# Altium project Design Documents.PrjPcb
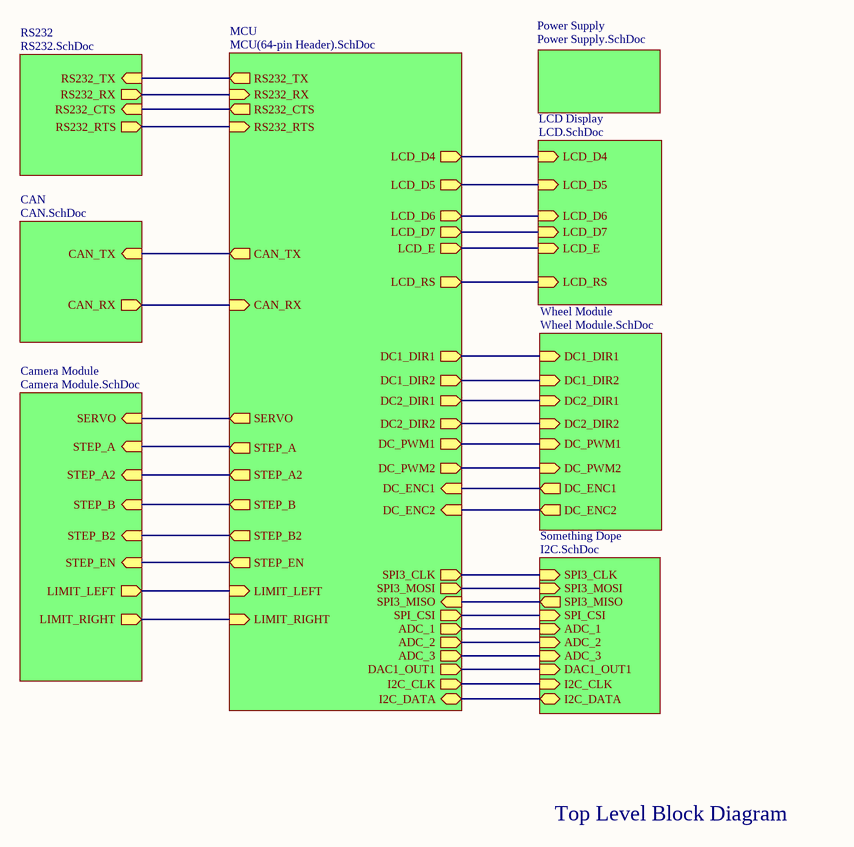
[diagram p0: Top Level Schematic.SchDoc]
9 sheets, 81 parts. Net scope: hierarchical (ports join the sheet entries above them; power ports are global).
Board file: Controller PCB.PcbDoc
Sheets:
  Top Level Schematic.SchDoc
    RS232 = RS232.SchDoc
    MCU = MCU(64-pin Header).SchDoc
    CAN = CAN.SchDoc
    Camera Module = Camera Module.SchDoc
    Wheel Module = Wheel Module.SchDoc
    Power Supply = Power Supply.SchDoc
    LCD Display = LCD.SchDoc
    Something Dope = I2C.SchDoc

## Sheet Top Level Schematic.SchDoc
size A; DocumentNumber: 1; SheetNumber: 1; SheetTotal: 9

### Sub-sheets
Camera Module = Camera Module.SchDoc: SERVO (in), STEP_A (in), STEP_A2 (in), STEP_B (in), STEP_B2 (in), STEP_EN (in), LIMIT_LEFT (out), LIMIT_RIGHT (out)
CAN = CAN.SchDoc: CAN_TX (in), CAN_RX (out)
LCD Display = LCD.SchDoc: LCD_D4 (in), LCD_D5 (in), LCD_D6 (in), LCD_E (in), LCD_RS (in), LCD_D7 (in)
MCU = MCU(64-pin Header).SchDoc: RS232_TX (out), RS232_RX (in), RS232_CTS (out), RS232_RTS (in), SERVO (out), STEP_A (out), STEP_A2 (out), STEP_B (out), STEP_B2 (out), STEP_EN (out), DC1_DIR1 (out), DC1_DIR2 (out), DC2_DIR1 (out), DC2_DIR2 (out), DC_PWM1 (out), DC_PWM2 (out), DC_ENC1 (in), DC_ENC2 (in), LIMIT_LEFT (in), LIMIT_RIGHT (in), CAN_TX (out), CAN_RX (in), LCD_D4 (out), LCD_D5 (out), LCD_D6 (out), LCD_E (out), LCD_RS (out), ADC_1 (out), ADC_2 (out), ADC_3 (out), DAC1_OUT1 (out), SPI_CSI (out), SPI3_MISO (in), SPI3_MOSI (out), SPI3_CLK (out), LCD_D7 (out), I2C_CLK (out), I2C_DATA (bidir)
Power Supply = Power Supply.SchDoc: no entries
RS232 = RS232.SchDoc: RS232_TX (in), RS232_RX (out), RS232_CTS (in), RS232_RTS (out)
Something Dope = I2C.SchDoc: SPI3_CLK (in), SPI3_MOSI (in), SPI3_MISO (out), SPI_CSI (in), ADC_1 (in), ADC_2 (in), ADC_3 (in), DAC1_OUT1 (in), I2C_CLK (in), I2C_DATA (bidir)
Wheel Module = Wheel Module.SchDoc: DC1_DIR1 (in), DC1_DIR2 (in), DC2_DIR1 (in), DC2_DIR2 (in), DC_PWM1 (in), DC_PWM2 (in), DC_ENC1 (out), DC_ENC2 (out)

### Nets
NetC9_2: sheet MCU/CAN_RX, sheet CAN/CAN_RX
NetCN1_1: sheet MCU/SPI3_CLK, sheet Something Dope/SPI3_CLK
NetCN1_2: sheet MCU/SPI3_MISO, sheet Something Dope/SPI3_MISO
NetCN1_3: sheet MCU/SPI3_MOSI, sheet Something Dope/SPI3_MOSI
NetCN1_4: sheet MCU/SPI_CSI, sheet Something Dope/SPI_CSI
NetCN1_21: sheet MCU/LCD_D7, sheet LCD Display/LCD_D7
NetCN1_25: sheet RS232/RS232_RTS, sheet MCU/RS232_RTS
NetCN1_27: sheet RS232/RS232_CTS, sheet MCU/RS232_CTS
NetCN1_28: sheet MCU/DC1_DIR1, sheet Wheel Module/DC1_DIR1
NetCN1_30: sheet MCU/DC1_DIR2, sheet Wheel Module/DC1_DIR2
NetCN1_32: sheet MCU/DAC1_OUT1, sheet Something Dope/DAC1_OUT1
NetCN1_34: sheet MCU/DC2_DIR1, sheet Wheel Module/DC2_DIR1
NetCN1_35: sheet MCU/ADC_3, sheet Something Dope/ADC_3
NetCN1_36: sheet MCU/ADC_2, sheet Something Dope/ADC_2
NetCN1_37: sheet MCU/STEP_EN, sheet Camera Module/STEP_EN
NetCN1_38: sheet MCU/ADC_1, sheet Something Dope/ADC_1
NetCN2_1: sheet MCU/STEP_B2, sheet Camera Module/STEP_B2
NetCN2_2: sheet MCU/STEP_B, sheet Camera Module/STEP_B
NetCN2_3: sheet MCU/I2C_CLK, sheet Something Dope/I2C_CLK
NetCN2_4: sheet MCU/STEP_A, sheet Camera Module/STEP_A
NetCN2_5: sheet MCU/I2C_DATA, sheet Something Dope/I2C_DATA
NetCN2_6: sheet RS232/RS232_RX, sheet MCU/RS232_RX
NetCN2_12: sheet MCU/CAN_TX, sheet CAN/CAN_TX
NetCN2_13: sheet MCU/DC_ENC1, sheet Wheel Module/DC_ENC1
NetCN2_15: sheet MCU/DC_ENC2, sheet Wheel Module/DC_ENC2
NetCN2_16: sheet MCU/LCD_E, sheet LCD Display/LCD_E
NetCN2_17: sheet MCU/LCD_D6, sheet LCD Display/LCD_D6
NetCN2_18: sheet MCU/SERVO, sheet Camera Module/SERVO
NetCN2_19: sheet MCU/STEP_A2, sheet Camera Module/STEP_A2
NetCN2_21: sheet MCU/DC_PWM2, sheet Wheel Module/DC_PWM2
NetCN2_22: sheet MCU/LIMIT_LEFT, sheet Camera Module/LIMIT_LEFT
NetCN2_23: sheet MCU/DC_PWM1, sheet Wheel Module/DC_PWM1
NetCN2_24: sheet MCU/DC2_DIR2, sheet Wheel Module/DC2_DIR2
NetCN2_25: sheet MCU/LIMIT_RIGHT, sheet Camera Module/LIMIT_RIGHT
NetCN2_27: sheet MCU/LCD_D4, sheet LCD Display/LCD_D4
NetCN2_29: sheet MCU/LCD_D5, sheet LCD Display/LCD_D5
NetCN2_30: sheet MCU/LCD_RS, sheet LCD Display/LCD_RS
NetCN2_34: sheet RS232/RS232_TX, sheet MCU/RS232_TX

### Notes on the sheet
- Top Level Block Diagram

## Sheet RS232.SchDoc
size A; SheetNumber: 4; SheetTotal: 9
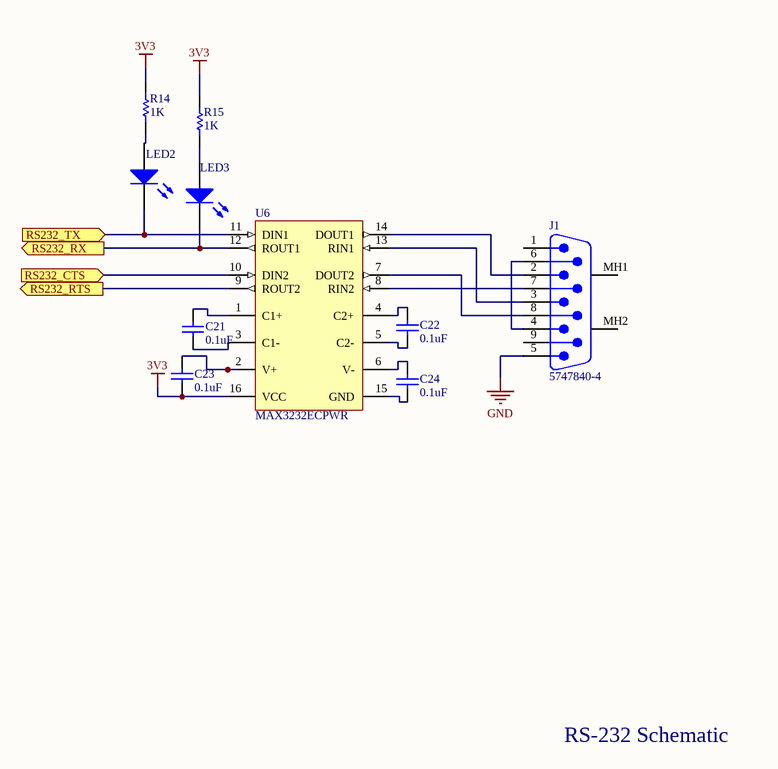
[diagram p1: RS232.SchDoc]

### Parts
C21  0.1uF  [CAPC1608X90X35LL15T15]
C22  0.1uF  [CAPC1608X90X35LL15T15]
C23  0.1uF  [CAPC1608X90X35ML15T15]
C24  0.1uF  [CAPC1608X90X35LL15T15]
J1  5747840-4  [TECO-5747840-4_V]
LED2  (no value)  [1204]
LED3  (no value)  [1204]
R14  1K  [RESC2013X60X30ML20T20]
R15  1K  [RESC2013X60X30ML20T20]
U6  MAX3232ECPWR  [PW0016A_M]

### Ports
RS232_CTS (in), RS232_RTS (out), RS232_RX (out), RS232_TX (in)

### Nets
3V3: C23.1 R14.1 R15.1 U6.16(VCC)
GND: J1.5
NetC21_1: C21.1 U6.3(C1-)
NetC21_2: C21.2 U6.1(C1+)
NetC22_1: C22.1 U6.5(C2-)
NetC22_2: C22.2 U6.4(C2+)
NetC23_2: C23.2 U6.2(V+)
NetC24_1: C24.1 U6.15(GND)
NetC24_2: C24.2 U6.6(V-)
NetCN1_25: U6.9(ROUT2) ; port RS232_RTS
NetCN1_27: U6.10(DIN2) ; port RS232_CTS
NetCN2_6: LED3.1(K) U6.12(ROUT1) ; port RS232_RX
NetCN2_34: LED2.1(K) U6.11(DIN1) ; port RS232_TX
NetJ1_2: J1.2 U6.14(DOUT1)
NetJ1_3: J1.3 U6.13(RIN1)
NetJ1_4: J1.4 J1.6
NetJ1_7: J1.7 U6.8(RIN2)
NetJ1_8: J1.8 U6.7(DOUT2)
NetLED2_2: LED2.2(A) R14.2
NetLED3_2: LED3.2(A) R15.2

Not connected (* = marked no-connect by the designer): J1 1 9 MH1 MH2

### Notes on the sheet
- RS-232 Schematic

### Library data of the parts
C21-C24 = CMP-2006-04389-2: Chip Capacitor, 100 nF, +/- 10%, 50 V, -55 to 125 degC, 0603 (1608 Metric), RoHS, Tape and Reel; Case\Package: 0603; Type (Capacitors): X7R; Capacitance: 100 nF; Voltage Rating: 50 V; Pins: 2; Max Operating Temperature: 125 degC; Min Operating Temperature: -55 degC; Case Code (Imperial): 0603; DatasheetVersion: 07/2016; Package Quantity: 4000; Length: 1.6 mm; REACH SVHC: No SVHC; Packaging: Tape and Reel; Case Code (Metric): 1608; Mounting Technology: Surface Mount; RoHSCompliant: true; Height: 0.9 mm; ComponentLink1URL: http://www.avx.com/; ComponentLink2URL: http://datasheets.avx.com/X7RDielectric.pdf; Mount: Surface Mount; ComponentLink2Description: Datasheet; Width: 0.81 mm; PackageReference: 0603; PackageDescription: 2-Pin Surface Mount Device, Body 1.6 x 0.81 mm; Radiation Hardening: No; ComponentLink1Description: Manufacturer URL; Voltage Rating (DC): 50 V; Tolerance: 10%
J1 = CMP-2000-05648-1: Male D-Sub Connector, Pitch 1.37 mm, 9 Position, Height 12.93 mm, Tail Length 3.55 mm, -55 to 105 degC, RoHS, Tray; Manufacturer: TE Connectivity; Current Rating: 6A; 3D Model: 5747840-4.pdf; Connector Type: Plug,MalePins; Catalog Drawings: AMPD-SubMale.318; Other Names: A32092; Product Training Modules: AMPLIMITED-SubConnectors; Number of Positions: 9; Dynamic Catalog: AMPLIMITEHD-20Series; Flange Feature: Housing/Shell(4-40); Mating Products: 5-747905-7-ND / -CONND-SUBRCPT9POSVERTSLD / 5-787355-1-ND / -CONNRCPT9POSVERTSOLDERCUP / 5746861-4-ND / -CONNRECEPT9POSGOLDIDC / A32510-ND / -CONND-SUBRCPT9POSSLDCUPAU / AFL09B-ND / -CONND-SUBRECEPT9POS30GOLD / A31975-ND / -CONND-SUBRECEPT9P22-26AWGAU / A31974-ND / -CONND-SUBRECEPT9P20-22AWGAU / A31973-ND / -CONND-SUBRECEPT9P26-30AWGAU / A31931-ND / -CONND-SUBRCPT9POS22-26AWGAU; Featured Product: AMPLIMITED-SubminiatureConnectors; Voltage Rating: 125V; Connector Style: D-Sub; Mounting Technology: ThroughHole; Features: BoardLock,GroundStrap,GroundingIndents; Operating Temperature: -55°C~105°C; Standard Package: 130; Termination: Solder; Contact Finish: Gold; Family: D-SubConnectors; Package Reference: 5747840-4; Package Description: 9-Pin Through Hole Device, Body 30.81 x 18.62 mm, Pitch 1.37 mm; Category: Connectors,Interconnects; Series: AMPLIMITEHD-20; Manufacturer URL: http://www.te.com/; Shell Size, Connector Layout: 1(DE,E); Color: Black; RoHS Information: 5747840-4StatementofCompliance; Shell Material, Finish: Steel,TinPlated; Datasheet URL: http://www.te.com/commerce/DocumentDelivery/DDEController?Action=showdoc&DocId=Customer+Drawing%7F5747840%7FD%7Fpdf%7FEnglish%7FENG_CD_5747840_D.pdf%7F5747840-4; Contact Finish Thickness: Flash; Datasheet Version: Rev. D, 01/2013; Mounting Type: ThroughHole,RightAngle; Number of Rows: 2; Contact Type: Signal
LED2 LED3 = CMP-1427-00002-1: SMD Side view mono-color Chip LED-Round , WL-SMSW, Green; PartNumber: 155124GS73200; Manufacturer: Wuerth Elektronik; Color: Yellow; PackageReference: 1204; ComponentLink2URL: http://katalog.we-online.com/led/datasheet/155124GS73200.pdf; ComponentLink2Description: Datasheet; ComponentLink1URL: http://www.we-online.com; ComponentLink1Description: Manufacturer URL
R14 R15 = CMP-2001-04656-1: Part Number: RK73B2ATTD102J; Manufacturer: KOA Speer
U6 = CMP-0299-01479-2: 3-V to 5.5-V Multichannel RS-232 Line Driver / Receiver with ±15-kV IEC ESD Protection, 0 to 70 degC, 16-Pin TSSOP (PW), Green (RoHS & no Sb/Br); Supply Voltage(s)(V): 3.3 or 5.0; Receivers Per Package: 2; ESD HBM(kV): +/-15; IEC-61000-4-2 SUPPORT: TRUE; ICC(Max)(mA): 1; ComponentLink2Description: Datasheet; PackageVersion: revG, Feb-2011; ComponentLink3Description: Package Specification; DatasheetVersion: SLLS664A; Drivers Per Package: 2; PackageDescription: 16-Pin Plastic Thin Small Outline Package 5 x 4.4 mm Body ,0.65 mm Pitch; ComponentLink3URL: http://www.ti.com/litv/pdf/mpds361; ComponentLink1Description: Manufacturer URL; ComponentLink2URL: http://www.ti.com/general/docs/lit/getliterature.tsp?genericPartNumber=MAX3232E&fileType=pdf; PackageReference: PW0016A; RS-232: TRUE; SubFamily: RS-232; Single Supply: TRUE; ComponentLink1URL: www.ti.com

## Sheet MCU(64-pin Header).SchDoc: 64-Pin Header (MCU)
size A; DrawnBy: Jeff Scherer; DocumentNumber: 2; Revision: 1; SheetNumber: 2; SheetTotal: 9
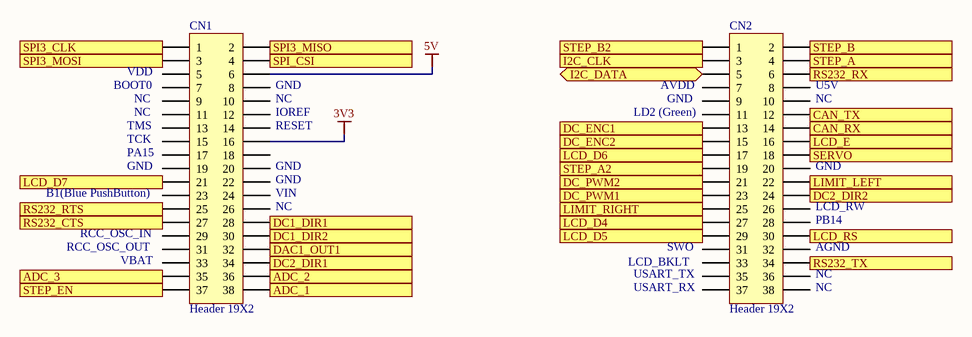
[diagram p2: MCU(64-pin Header).SchDoc]

### Parts
CN1  Header 19X2  [HDR2X19]
CN2  Header 19X2  [HDR2X19]

### Ports
ADC_1 (out), ADC_2 (out), ADC_3 (out), CAN_RX (in), CAN_TX (out), DAC1_OUT1 (out), DC1_DIR1 (out), DC1_DIR2 (out), DC2_DIR1 (out), DC2_DIR2 (out), DC_ENC1 (in), DC_ENC2 (in), DC_PWM1 (out), DC_PWM2 (out), I2C_CLK (out), I2C_DATA (bidir), LCD_D4 (out), LCD_D5 (out), LCD_D6 (out), LCD_D7 (out), LCD_E (out), LCD_RS (out), LIMIT_LEFT (in), LIMIT_RIGHT (in), RS232_CTS (out), RS232_RTS (in), RS232_RX (in), RS232_TX (out), SERVO (out), SPI3_CLK (out), SPI3_MISO (in), SPI3_MOSI (out), SPI_CSI (out), STEP_A2 (out), STEP_A (out), STEP_B2 (out), STEP_B (out), STEP_EN (out)

### Nets
3V3: CN1.16
5V: CN1.6
NetC9_2: CN2.14 ; port CAN_RX
NetCN1_1: CN1.1 ; port SPI3_CLK
NetCN1_2: CN1.2 ; port SPI3_MISO
NetCN1_3: CN1.3 ; port SPI3_MOSI
NetCN1_4: CN1.4 ; port SPI_CSI
NetCN1_21: CN1.21 ; port LCD_D7
NetCN1_25: CN1.25 ; port RS232_RTS
NetCN1_27: CN1.27 ; port RS232_CTS
NetCN1_28: CN1.28 ; port DC1_DIR1
NetCN1_30: CN1.30 ; port DC1_DIR2
NetCN1_32: CN1.32 ; port DAC1_OUT1
NetCN1_34: CN1.34 ; port DC2_DIR1
NetCN1_35: CN1.35 ; port ADC_3
NetCN1_36: CN1.36 ; port ADC_2
NetCN1_37: CN1.37 ; port STEP_EN
NetCN1_38: CN1.38 ; port ADC_1
NetCN2_1: CN2.1 ; port STEP_B2
NetCN2_2: CN2.2 ; port STEP_B
NetCN2_3: CN2.3 ; port I2C_CLK
NetCN2_4: CN2.4 ; port STEP_A
NetCN2_5: CN2.5 ; port I2C_DATA
NetCN2_6: CN2.6 ; port RS232_RX
NetCN2_12: CN2.12 ; port CAN_TX
NetCN2_13: CN2.13 ; port DC_ENC1
NetCN2_15: CN2.15 ; port DC_ENC2
NetCN2_16: CN2.16 ; port LCD_E
NetCN2_17: CN2.17 ; port LCD_D6
NetCN2_18: CN2.18 ; port SERVO
NetCN2_19: CN2.19 ; port STEP_A2
NetCN2_21: CN2.21 ; port DC_PWM2
NetCN2_22: CN2.22 ; port LIMIT_LEFT
NetCN2_23: CN2.23 ; port DC_PWM1
NetCN2_24: CN2.24 ; port DC2_DIR2
NetCN2_25: CN2.25 ; port LIMIT_RIGHT
NetCN2_27: CN2.27 ; port LCD_D4
NetCN2_29: CN2.29 ; port LCD_D5
NetCN2_30: CN2.30 ; port LCD_RS
NetCN2_34: CN2.34 ; port RS232_TX

Not connected (* = marked no-connect by the designer): CN1 5 7 8 9 10 11 12 13 14 15 17 18 19 20 22 23 24 26 29 31 33; CN2 7 8 9 10 11 20 26 28 31 32 33 35 36 37 38

### Notes on the sheet
- (near CN1) BOOT0
- (near CN1) VDD
- (near CN1) GND
- (near CN2) AVDD
- (near CN2) U5V
- (near CN1) TMS
- (near CN1) TCK
- (near CN1) PA15
- (near CN1) NC
- (near CN1) IOREF
- (near CN1) RESET
- (near CN2) LD2 (Green)
- (near CN2) GND
- (near CN2) NC
- (near CN1) B1(Blue PushButton)
- (near CN1) VIN
- (near CN2) PB14
- (near CN2) LCD_RW
- RCC_OSC_OUT
- (near CN1) RCC_OSC_IN
- (near CN1) VBAT
- (near CN2) LCD_BKLT
- (near CN2) USART_TX
- (near CN2) USART_RX
- (near CN2) SWO
- (near CN2) AGND

### Library data of the parts
CN1 CN2 = Header 19X2: Header, 19-Pin, Dual row; Revision: 17-Jul-2002: Re-released for DXP Platform.; Publisher: Altium Limited

## Sheet CAN.SchDoc
size A; DocumentNumber: 4; SheetNumber: 5; SheetTotal: 9
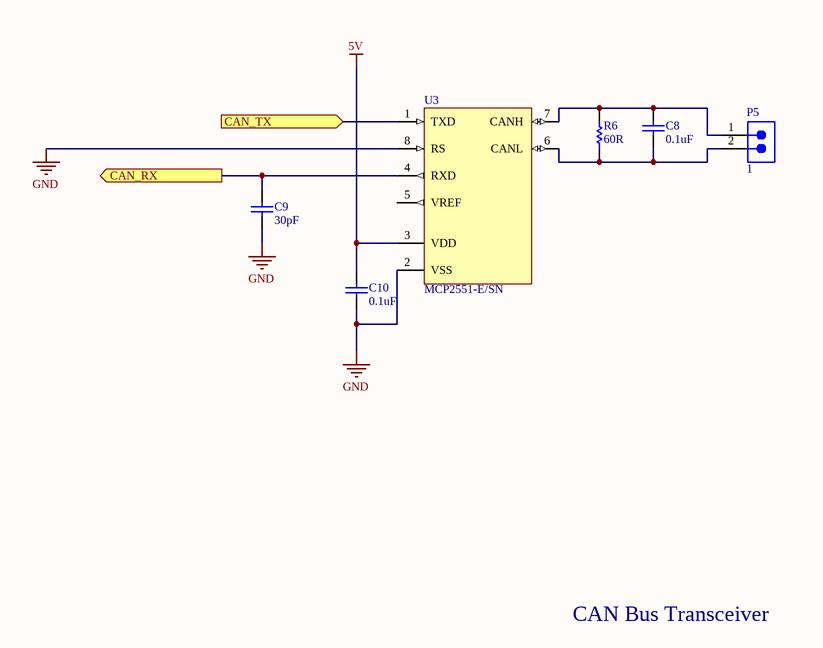
[diagram p3: CAN.SchDoc]

### Parts
C8  0.1uF  [CAPC1608X90X35LL15T15]
C9  30pF  [CAPC1608X87X35LL15T15]
C10  0.1uF  [CAPC1608X90X35LL15T15]
P5  1  [SMTC-DW-02-16-X-S-200]
R6  60R  [RESC1609X50X30NL10T20]
U3  MCP2551-E/SN  [SOIC-SN8_N]

### Ports
CAN_RX (out), CAN_TX (in)

### Nets
5V: C10.2 U3.3(VDD)
GND: C9.1 C10.1 U3.2(VSS) U3.8(RS)
NetC8_1: C8.1 P5.2 R6.1 U3.6(CANL)
NetC8_2: C8.2 P5.1 R6.2 U3.7(CANH)
NetC9_2: C9.2 U3.4(RXD) ; port CAN_RX
NetCN2_12: U3.1(TXD) ; port CAN_TX

Not connected (* = marked no-connect by the designer): U3 5(VREF)

### Notes on the sheet
- CAN Bus Transceiver

### Library data of the parts
C8 C10 = CMP-2006-04389-2: as C21 on sheet RS232; Pins: 2; Max Operating Temperature: 125 degC; Min Operating Temperature: -55 degC; Case Code (Imperial): 0603; DatasheetVersion: 07/2016; Package Quantity: 4000; Length: 1.6 mm; REACH SVHC: No SVHC; Packaging: Tape and Reel; Case Code (Metric): 1608; Mounting Technology: Surface Mount; RoHSCompliant: true; Height: 0.9 mm; ComponentLink1URL: http://www.avx.com/; ComponentLink2URL: http://datasheets.avx.com/X7RDielectric.pdf; Mount: Surface Mount; ComponentLink2Description: Datasheet; Width: 0.81 mm; PackageReference: 0603; PackageDescription: 2-Pin Surface Mount Device, Body 1.6 x 0.81 mm; Radiation Hardening: No; ComponentLink1Description: Manufacturer URL; Voltage Rating (DC): 50 V; Tolerance: 10%
C9 = CMP-2006-03166-1: Manufacturer: Kemet; Part Number: C0603C300J5GACTU
P5 = CMP-1024-00001-1: Flexible .025" SQ Board Stacker, Through-hole, Vertical, -55 to 125 degC, 2.54 mm Pitch, 2-Pin, Male, RoHS; PartNumber: DW-02-16-G-S-200; Manufacturer: Samtec; Pitch: 2.54 mm; ComponentLink1Description: Manufacturer URL; ComponentLink3Description: Package Specification; DatasheetVersion: F-214; ComponentLink1URL: http://www.samtec.com; RoHS: True; PackageVersion: AX, 8/1984; ComponentLink2URL: http://www.samtec.com/documents/webfiles/pdf/DW.PDF; ComponentLink2Description: Datasheet; Orientation: Vertical; PackageReference: DW-02-16-X-S-200; PackageDescription: Low Cost Board Spacer; ComponentLink3URL: http://www.samtec.com/documents/webfiles/cpdf/XW-XX-XX-XXX-X-XXXX-XXX-XX-XXX-MKT1.PDF; Mounting Technology: Through-hole; Temperature Range: -55 to 125 degC
R6 = CMP-2000-03838-1: Manufacturer: Vishay Dale; Part Number: CRCW060310K0JNEA
U3 = CMP-0186-00038-2: High-Speed CAN Transceiver, 8-Pin SOIC, Extended Temperature; PackageReference: SOIC-SN8; Code_JEDEC: MS-012; ComponentLink1Description: Manufacturer URL; ComponentLink1URL: http://www.microchip.com/; PackageVersion: revBB, Aug-2009; ComponentLink3Description: Package Specification; Code_IPC: SOIC127P600-8; ComponentLink2URL: http://ww1.microchip.com/downloads/en/DeviceDoc/21667F.pdf; RevisionNote: URLs added. DatasheetVersion updated.; ComponentLink3URL: http://www.microchip.com/stellent/groups/techpub_sg/documents/packagingspec/en012702.pdf; DatasheetVersion: revF, Jul-2010; ComponentLink2Description: Datasheet; PackageDescription: 8-Lead Plastic Small Outline (SN) - Narrow, 3.90mm Body [SOIC]

## Sheet Camera Module.SchDoc
size A; DocumentNumber: 5; SheetNumber: 7; SheetTotal: 9
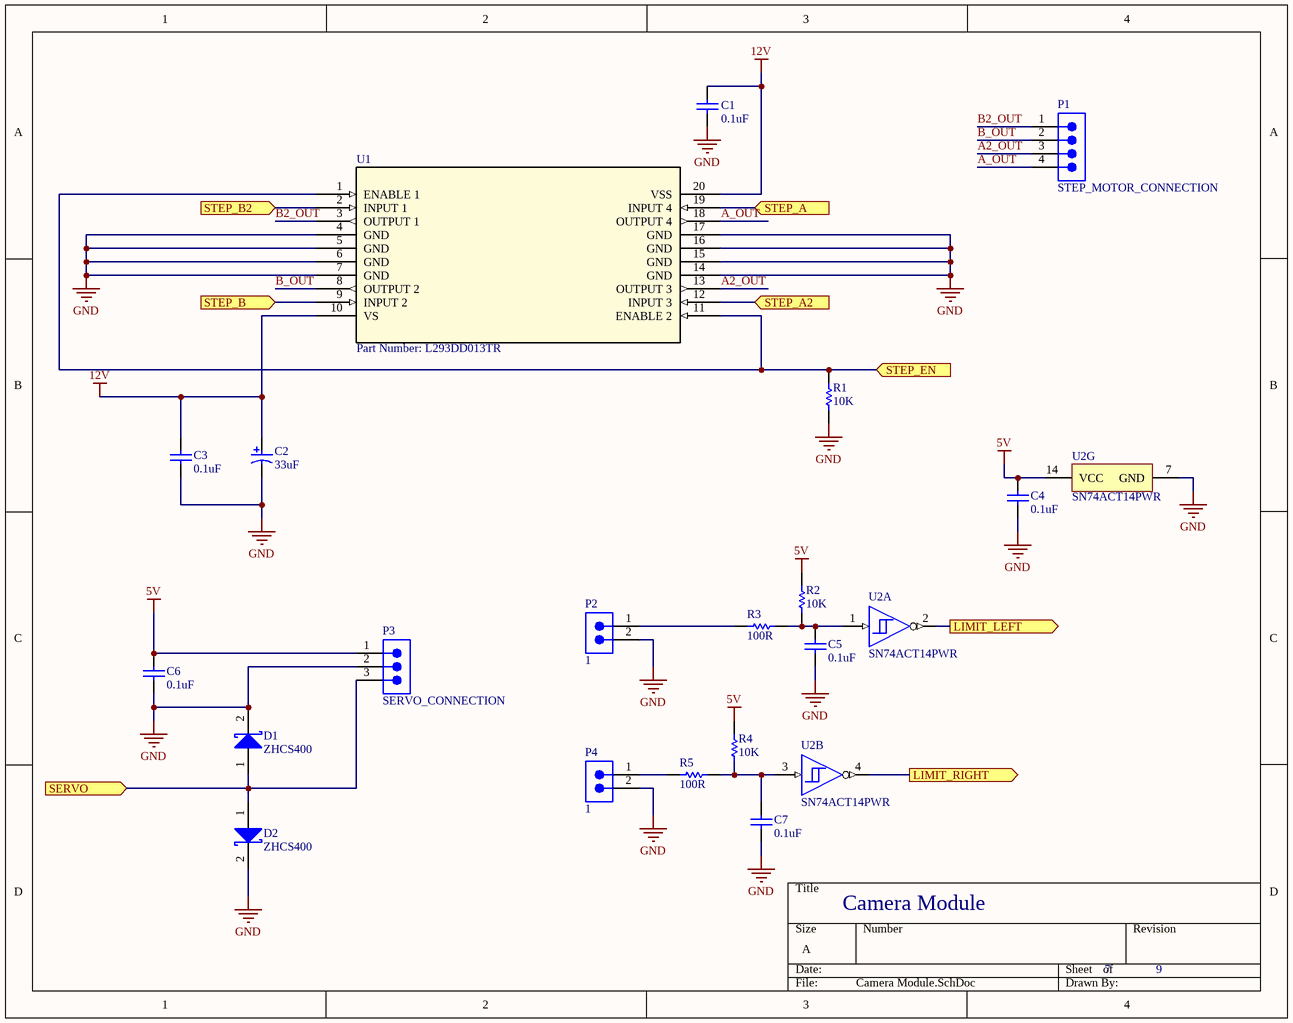
[diagram p4: Camera Module.SchDoc]

### Parts
C1  0.1uF  [CAPC1608X90X35LL15T15]
C2  33uF  [NIC-CAPA2-6.3X7.7_V]
C3  0.1uF  [CAPC1608X90X35LL15T15]
C4  0.1uF  [CAPC1608X90X35LL15T15]
C5  0.1uF  [CAPC1608X90X35LL15T15]
C6  0.1uF  [CAPC1608X90X35LL15T15]
C7  0.1uF  [CAPC1608X90X35LL15T15]
D1  ZHCS400  [DIOD-SOD323-2_V]
D2  ZHCS400  [DIOD-SOD323-2_V]
P1  STEP_MOTOR_CONNECTION  [SMTC-TSW-104-08-X-S]
P2  1  [SMTC-DW-02-16-X-S-200]
P3  SERVO_CONNECTION  [SMTC-TSW-103-07-X-S]
P4  1  [SMTC-DW-02-16-X-S-200]
R1  10K  [RESC1609X50X30ML10T20]
R2  10K  [RESC1609X50X30ML10T20]
R3  100R  [RESC1609X50X30ML10T20]
R4  10K  [RESC1609X50X30ML10T20]
R5  100R  [RESC1609X50X30ML10T20]
U1  Part Number: L293DD013TR  [SO-20]
U2  SN74ACT14PWR  [PW0014A_N]  (parts A,B,G of 7)

### Ports
LIMIT_LEFT (out), LIMIT_RIGHT (out), SERVO (in), STEP_A2 (in), STEP_A (in), STEP_B2 (in), STEP_B (in), STEP_EN (in)

### Nets
5V: C4.2 C6.2 P3.1(5V) R2.1 R4.1 U2.14(VCC)
12V: C1.2 C2.1 C3.2 U1.10(VS) U1.20(VSS)
GND: C1.1 C2.2 C3.1 C4.1 C5.1 C6.1 C7.1 D1.2(K) D2.2(K) P2.2 P3.2(Ground) P4.2 R1.1 U1.4(GND) U1.5(GND) U1.6(GND) U1.7(GND) U1.14(GND) U1.15(GND) U1.16(GND) U1.17(GND) U2.7(GND)
A2_OUT: P1.3 U1.13(OUTPUT_3)
A_OUT: P1.4 U1.18(OUTPUT_4)
B2_OUT: P1.1 U1.3(OUTPUT_1)
B_OUT: P1.2 U1.8(OUTPUT_2)
NetC5_2: C5.2 R2.2 R3.2 U2.1(1A)
NetC7_2: C7.2 R4.2 R5.2 U2.3(2A)
NetCN1_37: R1.2 U1.1(ENABLE_1) U1.11(ENABLE_2) ; port STEP_EN
NetCN2_1: U1.2(INPUT_1) ; port STEP_B2
NetCN2_2: U1.9(INPUT_2) ; port STEP_B
NetCN2_4: U1.19(INPUT_4) ; port STEP_A
NetCN2_18: D1.1(A) D2.1(A) P3.3(Signal) ; port SERVO
NetCN2_19: U1.12(INPUT_3) ; port STEP_A2
NetCN2_22: U2.2(~{1Y}) ; port LIMIT_LEFT
NetCN2_25: U2.4(~{2Y}) ; port LIMIT_RIGHT
NetP2_1: P2.1 R3.1
NetP4_1: P4.1 R5.1

### Notes on the sheet
- Camera Module

### Library data of the parts
C1 C3-C7 = CMP-2006-04389-2: as C21 on sheet RS232; Pins: 2; Max Operating Temperature: 125 degC; Min Operating Temperature: -55 degC; Case Code (Imperial): 0603; DatasheetVersion: 07/2016; Package Quantity: 4000; Length: 1.6 mm; REACH SVHC: No SVHC; Packaging: Tape and Reel; Case Code (Metric): 1608; Mounting Technology: Surface Mount; RoHSCompliant: true; Height: 0.9 mm; ComponentLink1URL: http://www.avx.com/; ComponentLink2URL: http://datasheets.avx.com/X7RDielectric.pdf; Mount: Surface Mount; ComponentLink2Description: Datasheet; Width: 0.81 mm; PackageReference: 0603; PackageDescription: 2-Pin Surface Mount Device, Body 1.6 x 0.81 mm; Radiation Hardening: No; ComponentLink1Description: Manufacturer URL; Voltage Rating (DC): 50 V; Tolerance: 10%
C2 = CMP-0687-00057-1: Aluminum Electrolytic Capacitor, UD Series, Low Impedance, 33 uF, 50 V, + / - 20%, -55 to 105 degC, Chip Type, 6.3 x 7.7 mm D x L, Pb-Free, Reel; PartNumber: UUD1H330MCL1GS; Manufacturer: Nichicon; Endurance Time: 2000 h; Rated Voltage: 50 V; Rated Ripple Current (at 100kHz): 185 mA; Packing: Dia382mm Reel; Tolerance Rated Capacitance: -20 to 20%; Impedance: 0.68 Ohm; Mounting Technology: Surface Mount; DatasheetVersion: 08/2012; PackageReference: CAPAE-D6.3H7.7; ComponentLink1Description: Manufacturer URL; ComponentLink1URL: http://www.nichicon.co.jp/; Length: 7.7 mm; PackageDescription: 2-Pin Surface Mount Device, Diameter 6.3 mm, Height 7.7 mm, Pitch 5.4 mm; Diameter: 6.3 mm; Rated Capacitance: 33 uF; ComponentLink3Description: Package Specification; RoHS: TRUE; ComponentLink2Description: Datasheet; ComponentLink2URL: http://products.nichicon.co.jp/en/pdf/XJA043/e-ud.pdf; ComponentLink3URL: http://products.nichicon.co.jp/en/pdf/XJA043/e-ud.pdf
D1 D2 = CMP-0303-00001-1: Schottky Diode, 400mA; Manufacturer: Diodes Inc; Reverse Voltage: 40 V; Power Dissipation: 250 mW; Reverse Current: 40 uA@Vr=30 V; Packing Type: Tape and Reel; Forward Voltage: 425 mV@If=400 mA; PartNumber: ZHCS400; ComponentLink3URL: http://www.diodes.com/datasheets/ap02002.pdf; Moisture Sensitivity Level: 1; ComponentLink2URL: http://www.diodes.com/datasheets/ZHCS400.pdf; PackageDescription: 2-Pin SMT Diode, 1.7 x 1.3 mm Body; ComponentLink2Description: Datasheet; PackageReference: SOD323; ComponentLink1Description: Manufacturer URL; Mounting Technology: Surface Mount; DatasheetVersion: Rev. 8-2, 03/2012; ComponentLink1URL: http://www.diodes.com/; Storage Temperature: -55 to 150 degC; ComponentLink3Description: Package Specification; PackageVersion: Rev. 73
P1 = CMP-1024-00358-1: 0.025" SQ Post Header, Through-hole, Vertical, -55 to 125 degC, 2.54 mm Pitch, 4-Pin, Male, RoHS; PartNumber: TSW-104-08-L-S; Manufacturer: Samtec; Pitch: 2.54 mm; RoHS: True; Temperature Range: -55 to 125 degC; PackageDescription: .025[0.64] SQ. Post Terminal Strip Assembly; Orientation: Vertical; ComponentLink2URL: http://www.samtec.com/documents/webfiles/pdf/TSW_TH.PDF; ComponentLink1Description: Manufacturer URL; ComponentLink2Description: Datasheet; PackageVersion: DM, 8/1988; ComponentLink3URL: http://www.samtec.com/documents/webfiles/cpdf/TSW-XXX-XX-XXX-X-XX-XXX-MKT.pdf; Mounting Technology: Through-hole; PackageReference: TSW-104-08-X-S; ComponentLink3Description: Package Specification; ComponentLink1URL: http://www.samtec.com; DatasheetVersion: F-214
P2 P4 = CMP-1024-00001-1: as P5 on sheet CAN; ComponentLink1Description: Manufacturer URL; ComponentLink3Description: Package Specification; DatasheetVersion: F-214; ComponentLink1URL: http://www.samtec.com; RoHS: True; PackageVersion: AX, 8/1984; ComponentLink2URL: http://www.samtec.com/documents/webfiles/pdf/DW.PDF; ComponentLink2Description: Datasheet; Orientation: Vertical; PackageReference: DW-02-16-X-S-200; PackageDescription: Low Cost Board Spacer; ComponentLink3URL: http://www.samtec.com/documents/webfiles/cpdf/XW-XX-XX-XXX-X-XXXX-XXX-XX-XXX-MKT1.PDF; Mounting Technology: Through-hole; Temperature Range: -55 to 125 degC
P3 = CMP-1024-00334-1: 0.025" SQ Post Header, Through-hole, Vertical, -55 to 125 degC, 2.54 mm Pitch, 3-Pin, Male, RoHS; Manufacturer: Samtec; PartNumber: TSW-103-07-L-S; Pitch: 2.54 mm; Mounting Technology: Through-hole; ComponentLink2URL: http://www.samtec.com/documents/webfiles/pdf/TSW_TH.PDF; ComponentLink3Description: Package Specification; PackageVersion: DM, 8/1988; PackageReference: TSW-103-07-X-S; Orientation: Vertical; ComponentLink1URL: http://www.samtec.com; PackageDescription: .025[0.64] SQ. Post Terminal Strip Assembly; ComponentLink1Description: Manufacturer URL; ComponentLink2Description: Datasheet; ComponentLink3URL: http://www.samtec.com/documents/webfiles/cpdf/TSW-XXX-XX-XXX-X-XX-XXX-MKT.pdf; RoHS: True; DatasheetVersion: F-214; Temperature Range: -55 to 125 degC
R1 R2 R4 = CMP-2000-03838-1: as R6 on sheet CAN
R3 R5 = CMP-2000-03827-1: Part Number: CRCW0603100RJNEA; Manufacturer: Vishay Dale
U1 = L293DD013TR: No Description Available; Vendor: STMicroelectronics; Built_By: EMA_UL_Team; Manufacturer_Part_Number: L293DD013TR; Copyright: Copyright (C) 2018 Accelerated Designs. All rights reserved; RefDes: RefDes; Type: DEV; Value: Value
U2 = CMP-0268-00001-5: Hex Schmitt-Trigger Inverters, PW0014A, LARGE T&R; Manufacturer: Texas Instruments; Voltage(Nom)(V): 5; F @ Nom Voltage(Max)(Mhz): 90; Input Type: TTL; tpd @ Nom Voltage(Max)(ns): 12.5; Output Type: CMOS; Bits(#): 6; VCC(Max)(V): 5.5; Technology Family: ACT; Output Drive (IOL/IOH)(Max)(mA): -24/24; ICC @ Nom Voltage(Max)(mA): 0.02; Schmitt Trigger: Yes; VCC(Min)(V): 4.5; Rating: Catalog; Code_JEDEC: MO-153; PackageReference: PW0014A; Operating Temperature Range(C): -40 to 85; Generic Part Number: SN74ACT14; DatasheetVersion: SCAS557H

## Sheet Wheel Module.SchDoc
size A; DocumentNumber: 6; SheetNumber: 8; SheetTotal: 9
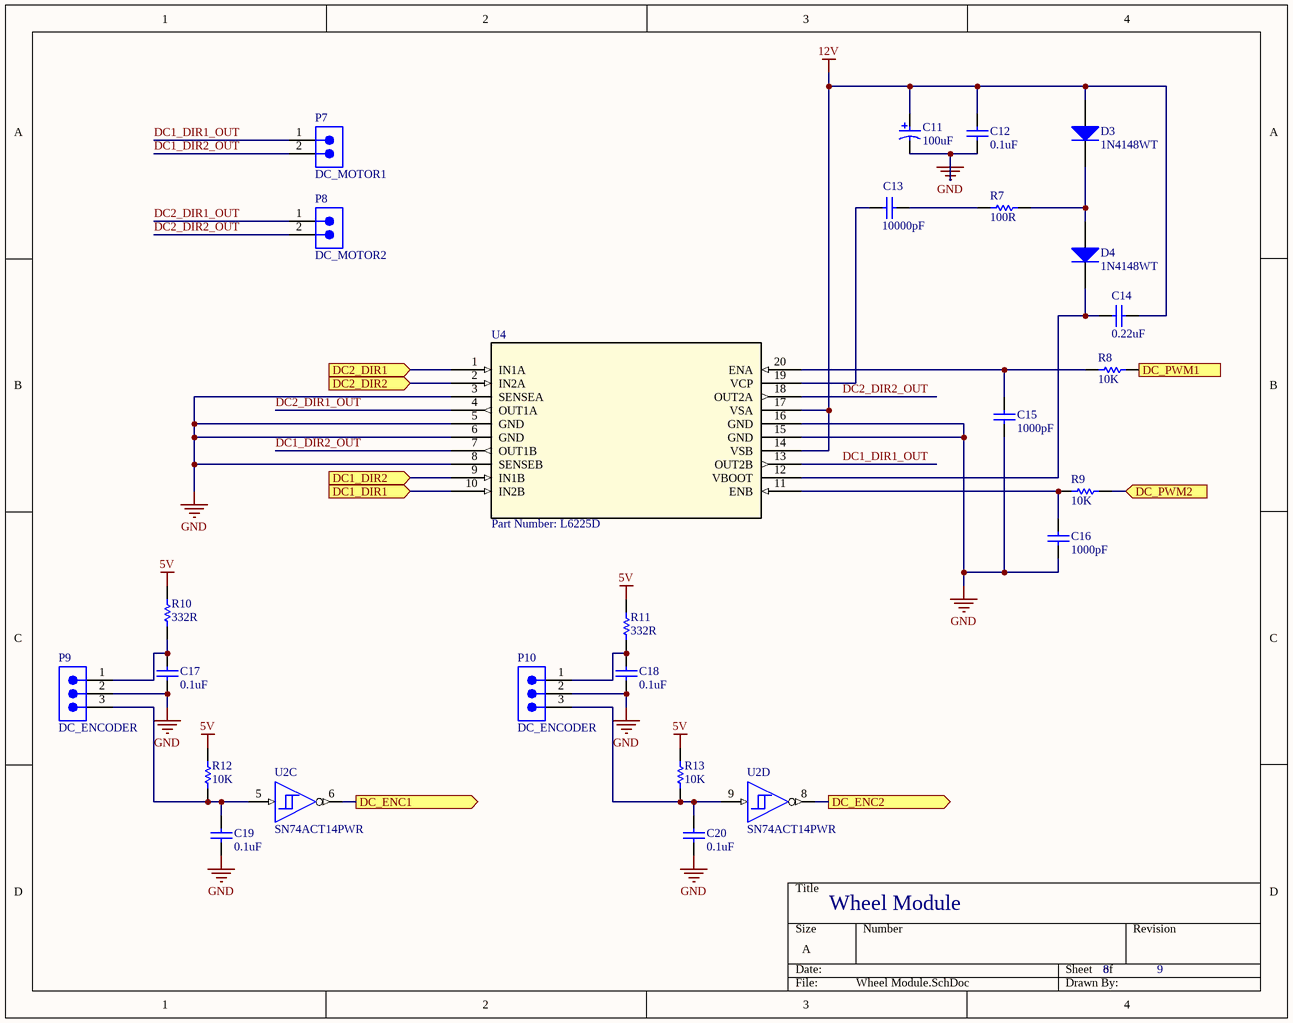
[diagram p5: Wheel Module.SchDoc]

### Parts
C11  100uF  [NIC-CAPA2-6.3X5.8_V]
C12  0.1uF  [CAPC1608X90X35LL15T15]
C13  10000pF  [CAPC1608X90X35LL15T15]
C14  0.22uF  [CAPC1608X90X35ML10T15]
C15  1000pF  [CAPC2013X140X50NL20T25]
C16  1000pF  [CAPC2013X140X50NL20T25]
C17  0.1uF  [CAPC1608X90X35LL15T15]
C18  0.1uF  [CAPC1608X90X35LL15T15]
C19  0.1uF  [CAPC1608X90X35LL15T15]
C20  0.1uF  [CAPC1608X90X35LL15T15]
D3  1N4148WT  [FAIR-SOD-523F-2_V]
D4  1N4148WT  [FAIR-SOD-523F-2_V]
P7  DC_MOTOR1  [SMTC-DW-02-16-X-S-200]
P8  DC_MOTOR2  [SMTC-DW-02-16-X-S-200]
P9  DC_ENCODER  [SMTC-TSW-103-07-X-S]
P10  DC_ENCODER  [SMTC-TSW-103-07-X-S]
R7  100R  [RESC1609X50X30ML10T20]
R8  10K  [RESC1609X50X30ML10T20]
R9  10K  [RESC1609X50X30ML10T20]
R10  332R  [RESC1608X55X30ML15T15]
R11  332R  [RESC1608X55X30ML15T15]
R12  10K  [RESC1609X50X30ML10T20]
R13  10K  [RESC1609X50X30ML10T20]
U2  SN74ACT14PWR  [PW0014A_N]  (parts C,D of 7)
U4  Part Number: L6225D  [SO-20]

### Ports
DC1_DIR1 (in), DC1_DIR2 (in), DC2_DIR1 (in), DC2_DIR2 (in), DC_ENC1 (out), DC_ENC2 (out), DC_PWM1 (in), DC_PWM2 (in)

### Nets
5V: R10.2 R11.2 R12.1 R13.1
12V: C11.1 C12.2 C14.2 D3.2(A) U4.14(VSB) U4.17(VSA)
GND: C11.2 C12.1 C15.1 C16.1 C17.1 C18.1 C19.1 C20.1 P9.2(Ground) P10.2(Ground) U4.3(SENSEA) U4.5(GND) U4.6(GND) U4.8(SENSEB) U4.15(GND) U4.16(GND)
DC1_DIR1_OUT: P7.1 U4.13(OUT2B)
DC1_DIR2_OUT: P7.2 U4.7(OUT1B)
DC2_DIR1_OUT: P8.1 U4.4(OUT1A)
DC2_DIR2_OUT: P8.2 U4.18(OUT2A)
NetC13_1: C13.1 U4.19(VCP)
NetC13_2: C13.2 R7.1
NetC14_1: C14.1 D4.1(K) U4.12(VBOOT)
NetC15_2: C15.2 R8.2 U4.20(ENA)
NetC16_2: C16.2 R9.2 U4.11(ENB)
NetC17_2: C17.2 P9.1(5V) R10.1
NetC18_2: C18.2 P10.1(5V) R11.1
NetC19_2: C19.2 P9.3(Signal) R12.2 U2.5(3A)
NetC20_2: C20.2 P10.3(Signal) R13.2 U2.9(4A)
NetCN1_28: U4.10(IN2B) ; port DC1_DIR1
NetCN1_30: U4.9(IN1B) ; port DC1_DIR2
NetCN1_34: U4.1(IN1A) ; port DC2_DIR1
NetCN2_13: U2.6(~{3Y}) ; port DC_ENC1
NetCN2_15: U2.8(~{4Y}) ; port DC_ENC2
NetCN2_21: R9.1 ; port DC_PWM2
NetCN2_23: R8.1 ; port DC_PWM1
NetCN2_24: U4.2(IN2A) ; port DC2_DIR2
NetD3_1: D3.1(K) D4.2(A) R7.2

### Notes on the sheet
- Wheel Module

### Library data of the parts
C11 = CMP-0687-00050-1: Aluminum Electrolytic Capacitor, UD Series, Low Impedance, 100 uF, 16 V, + / - 20%, -55 to 105 degC, Chip Type, 6.3 x 5.8 mm D x L, Pb-Free, Reel; PartNumber: UUD1C101MCL1GS; Manufacturer: Nichicon; Tolerance Rated Capacitance: -20 to 20%; Impedance: 0.44 Ohm; Rated Voltage: 16 V; Endurance Time: 2000 h; Packing: Dia382mm Reel; Rated Ripple Current (at 100kHz): 230 mA; PackageReference: CAPAE-D6.3H5.8; ComponentLink2URL: http://products.nichicon.co.jp/en/pdf/XJA043/e-ud.pdf; ComponentLink3Description: Package Specification; Mounting Technology: Surface Mount; Rated Capacitance: 100 uF; RoHS: TRUE; Diameter: 6.3 mm; Length: 5.8 mm; ComponentLink3URL: http://products.nichicon.co.jp/en/pdf/XJA043/e-ud.pdf; ComponentLink1Description: Manufacturer URL; ComponentLink2Description: Datasheet; PackageDescription: 2-Pin Surface Mount Device, Diameter 6.3 mm, Height 5.8 mm, Pitch 5.4 mm; DatasheetVersion: 08/2012; ComponentLink1URL: http://www.nichicon.co.jp/
C12 C17-C20 = CMP-2006-04389-2: as C21 on sheet RS232; Pins: 2; Max Operating Temperature: 125 degC; Min Operating Temperature: -55 degC; Case Code (Imperial): 0603; DatasheetVersion: 07/2016; Package Quantity: 4000; Length: 1.6 mm; REACH SVHC: No SVHC; Packaging: Tape and Reel; Case Code (Metric): 1608; Mounting Technology: Surface Mount; RoHSCompliant: true; Height: 0.9 mm; ComponentLink1URL: http://www.avx.com/; ComponentLink2URL: http://datasheets.avx.com/X7RDielectric.pdf; Mount: Surface Mount; ComponentLink2Description: Datasheet; Width: 0.81 mm; PackageReference: 0603; PackageDescription: 2-Pin Surface Mount Device, Body 1.6 x 0.81 mm; Radiation Hardening: No; ComponentLink1Description: Manufacturer URL; Voltage Rating (DC): 50 V; Tolerance: 10%
C13 = CMP-2006-04374-1: Manufacturer: AVX Interconnect / Elco; Part Number: 06035C-103KAT2A
C14 = CMP-2006-02784-1: Manufacturer: Murata; Part Number: GRM188F51H224ZA01D
C15 C16 = CMP-2007-04527-1: Manufacturer: AVX Interconnect / Elco; Part Number: 08051A102JAT2A
D3 D4 = CMP-0881-00001-1: High Conductance Fast Switching Diode, 75 V, -55 to 150 degC, 2-Pin SOD523F, RoHS; Manufacturer: Fairchild Semiconductor; IR (VR: 75 V)=5 uA Max.; VF: 1 V Max.; BVR (IR: 5 uA)=75 V Min.; CO: 4 pF Max.; DatasheetVersion: Rev. A2; ComponentLink1Description: Manufacturer URL; PackageDescription: 2-Pin Surface Mount Device, Body 1.2 x 0.8 mm, Height 0.7 mm; ComponentLink2URL: http://www.fairchildsemi.com/ds/1N/1N4148WT.pdf; ComponentLink2Description: Datasheet; PartNumber: 1N4148WT; ComponentLink1URL: http://www.fairchildsemi.com/; Temperature Range: -55 to 150 degC; Mounting Technology: Surface Mount; PackageReference: SOD-523F-2; RoHS: TRUE
P7 P8 = CMP-1024-00001-1: as P5 on sheet CAN; ComponentLink1Description: Manufacturer URL; ComponentLink3Description: Package Specification; DatasheetVersion: F-214; ComponentLink1URL: http://www.samtec.com; RoHS: True; PackageVersion: AX, 8/1984; ComponentLink2URL: http://www.samtec.com/documents/webfiles/pdf/DW.PDF; ComponentLink2Description: Datasheet; Orientation: Vertical; PackageReference: DW-02-16-X-S-200; PackageDescription: Low Cost Board Spacer; ComponentLink3URL: http://www.samtec.com/documents/webfiles/cpdf/XW-XX-XX-XXX-X-XXXX-XXX-XX-XXX-MKT1.PDF; Mounting Technology: Through-hole; Temperature Range: -55 to 125 degC
P9 P10 = CMP-1024-00334-1: as P3 on sheet Camera Module; Mounting Technology: Through-hole; ComponentLink2URL: http://www.samtec.com/documents/webfiles/pdf/TSW_TH.PDF; ComponentLink3Description: Package Specification; PackageVersion: DM, 8/1988; PackageReference: TSW-103-07-X-S; Orientation: Vertical; ComponentLink1URL: http://www.samtec.com; PackageDescription: .025[0.64] SQ. Post Terminal Strip Assembly; ComponentLink1Description: Manufacturer URL; ComponentLink2Description: Datasheet; ComponentLink3URL: http://www.samtec.com/documents/webfiles/cpdf/TSW-XXX-XX-XXX-X-XX-XXX-MKT.pdf; RoHS: True; DatasheetVersion: F-214; Temperature Range: -55 to 125 degC
R7 = CMP-2000-03827-1: as R3 on sheet Camera Module
R8 R9 R12 R13 = CMP-2000-03838-1: as R6 on sheet CAN
R10 R11 = CMP-2000-00439-1: Part Number: ERJ-3EKF3320V; Manufacturer: Panasonic
U2 = CMP-0268-00001-5: as U2 on sheet Camera Module; Code_JEDEC: MO-153; PackageReference: PW0014A; Operating Temperature Range(C): -40 to 85; Generic Part Number: SN74ACT14; DatasheetVersion: SCAS557H
U4 = L6225D: No Description Available; Vendor: STMicroelectronics; Built_By: EMA_UL_Team; Manufacturer_Part_Number: L6225D; Copyright: Copyright (C) 2018 Accelerated Designs. All rights reserved; RefDes: RefDes; Type: DEV; Value: Value

## Sheet Power Supply.SchDoc
size A4; DocumentNumber: 8; SheetNumber: 3; SheetTotal: 9
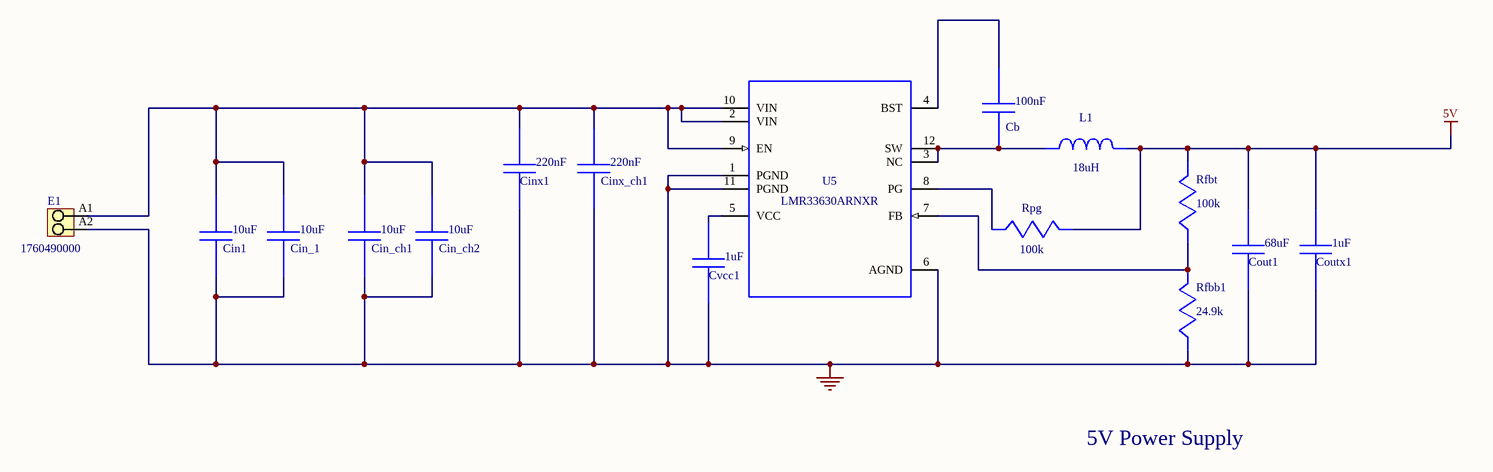
[diagram p6: Power Supply.SchDoc]

### Parts
Cb  value 100nF  [0805]  (hidden comment: CC0805KRX7R9BB104)
Cin1  value 10uF  [0805]  (hidden comment: GRM32ER71J106KA12L)
Cin_1  value 10uF  [0805]  (hidden comment: GRM32ER71J106KA12L)
Cin_ch1  value 10uF  [0805]  (hidden comment: GRM32ER71J106KA12L)
Cin_ch2  value 10uF  [0805]  (hidden comment: GRM32ER71J106KA12L)
Cinx1  value 220nF  [0603]  (hidden comment: C2012X5R1H224K125AA)
Cinx_ch1  value 220nF  [0603]  (hidden comment: C2012X5R1H224K125AA)
Cout1  value 68uF  [1210_280]  (hidden comment: C3225X5R0J686M200AC)
Coutx1  value 1uF  [0805]  (hidden comment: GRM21BR71A105KA01L)
Cvcc1  value 1uF  [0805]  (hidden comment: C0603C105Z8VACTU)
E1  1760490000  [PM_5_08_90_02]
L1  value 18uH  [CDRH125]  (hidden comment: CDRH125NP-180MC)
Rfbb1  value 24.9k  [0805]  (hidden comment: ERJ-6ENF2492V)
Rfbt  value 100k  [0805]  (hidden comment: CRCW0402100KFKED)
Rpg  value 100k  [0805]  (hidden comment: CRCW0402100KFKED)
U5  LMR33630ARNXR  [RNX0012B]

### Nets
5V: Cout1.1 Coutx1.1 L1.2 Rfbt.1 Rpg.1
GND: Cin1.2 Cin_1.2 Cin_ch1.2 Cin_ch2.2 Cinx1.2 Cinx_ch1.2 Cout1.2 Coutx1.2 Cvcc1.2 E1.A2 Rfbb1.2 U5.1(PGND) U5.6(AGND) U5.11(PGND)
NetCb_1: Cb.1 U5.4(BST)
NetCb_2: Cb.2 L1.1 U5.3(NC) U5.12(SW)
NetCin1_1: Cin1.1 Cin_1.1 Cin_ch1.1 Cin_ch2.1 Cinx1.1 Cinx_ch1.1 E1.A1 U5.2(VIN) U5.9(EN) U5.10(VIN)
NetCvcc1_1: Cvcc1.1 U5.5(VCC)
NetRfbb1_1: Rfbb1.1 Rfbt.2 U5.7(FB)
NetRpg_2: Rpg.2 U5.8(PG)

### Notes on the sheet
- 5V Power Supply

### Library data of the parts
Cb = CC0805KRX7R9BB104: CC0805KRX7R9BB10; Manufacturer Name: Yageo; PackageReference: CC0805KRX7R9BB104; Manufacturer Part Number: CC0805KRX7R9BB104
Cin1 Cin_1 Cin_ch1 Cin_ch2 = GRM32ER71J106KA12L: GRM32ER71J106KA1; Manufacturer Name: MuRata; PackageReference: GRM32ER71J106KA12L; Manufacturer Part Number: GRM32ER71J106KA12L
Cinx1 Cinx_ch1 = C2012X5R1H224K125AA: C2012X5R1H224K12; Manufacturer Name: TDK; PackageReference: C2012X5R1H224K125AA; Manufacturer Part Number: C2012X5R1H224K125AA
Cout1 = C3225X5R0J686M200AC: C3225X5R0J686M20; Manufacturer Name: TDK; PackageReference: C3225X5R0J686M200AC; Manufacturer Part Number: C3225X5R0J686M200AC
Coutx1 = GRM21BR71A105KA01L: GRM21BR71A105KA0; Manufacturer Name: MuRata; PackageReference: GRM21BR71A105KA01L; Manufacturer Part Number: GRM21BR71A105KA01L
Cvcc1 = C0603C105Z8VACTU: Manufacturer Name: Kemet; PackageReference: C0603C105Z8VACTU; Manufacturer Part Number: C0603C105Z8VACTU
E1 = CMP-1559-01627-1: OMNIMATE Signal - series PM; Manufacturer: Weidmueller; Contact_surface: tinned; Pitch_mm: 5,08 mm; Solid_min_H05_07_V_U: 0,13 mm²; Wire_cross_section_AWG_min_UL_1059: AWG 26; Wire_cross_section_AWG_max_UL_1059: AWG 14; Rated_voltage_for_surge_voltage_class_pollution_degree_II_2: 600 V; Rated_current_use_group_B_UL_1059: 15 A; Mounting_onto_the_PCB: Solder connection; Solder_pin_length_mm: 3,5 mm; Side_termination_characteristic: closed side; Contact_material: Cu-Leg; Pitch_inch: 0,2 inch; No_of_poles: 2; UL_94_flammability_rating: V-0; Insulating_material: Wemid (PA); Rated_voltage_use_group_B_UL_1059: 300 V; Solid_max_H05_07_V_U: 2,5 mm²; Short_text_for_material: PM 5.08/02/90 3.5SN OR BX; Revision: V1; PartNumber: 1760490000; Qty: 500 PCS; ComponentLink2Description: URL Link1; Packaging: Box; PackageReference: PM_5_08_90_02; ComponentLink2URL: http://catalog.weidmueller.com/catalog/Start.do?localeId=en&ObjectID=1760490000; Colour: Orange; ComponentLink1Description: Manufacturer URL; ComponentLink1URL: http://www.weidmueller.com/
L1 = CDRH125NP-180MC: Manufacturer Name: Sumida; PackageReference: CDRH125NP-180MC; Manufacturer Part Number: CDRH125NP-180MC
Rfbb1 = ERJ-6ENF2492V: Manufacturer Name: Panasonic; PackageReference: ERJ-6ENF2492V; Manufacturer Part Number: ERJ-6ENF2492V
Rfbt Rpg = CRCW0402100KFKED: Manufacturer Name: Vishay-Dale; PackageReference: CRCW0402100KFKED; Manufacturer Part Number: CRCW0402100KFKED
U5 = LMR33630ARNXR: Manufacturer Name: Texas Instruments; PackageReference: LMR33630ARNXR; Manufacturer Part Number: LMR33630ARNXR; Value: N/A

## Sheet LCD.SchDoc
size A; DocumentNumber: 7; SheetNumber: 6; SheetTotal: 9
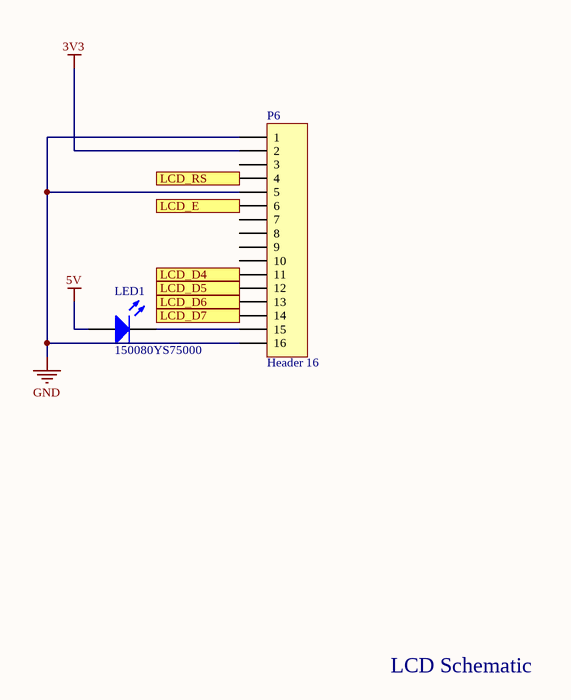
[diagram p7: LCD.SchDoc]

### Parts
LED1  150080YS75000  [0805_A]
P6  Header 16  [HDR1X16]

### Ports
LCD_D4 (in), LCD_D5 (in), LCD_D6 (in), LCD_D7 (in), LCD_E (in), LCD_RS (in)

### Nets
3V3: P6.2
5V: LED1.2(A)
GND: P6.1 P6.5 P6.16
NetCN1_21: P6.14 ; port LCD_D7
NetCN2_16: P6.6 ; port LCD_E
NetCN2_17: P6.13 ; port LCD_D6
NetCN2_27: P6.11 ; port LCD_D4
NetCN2_29: P6.12 ; port LCD_D5
NetCN2_30: P6.4 ; port LCD_RS
NetLED1_1: LED1.1(K) P6.15

Not connected (* = marked no-connect by the designer): P6 3 7 8 9 10

### Notes on the sheet
- LCD Schematic

### Library data of the parts
LED1 = CMP-1426-00012-1: SMD mono-color Chip LED, WL-SMCW, Yellow; Manufacturer: Wuerth Elektronik; Color: Yellow; ComponentLink1URL: http://www.we-online.com; PackageReference: 0805_A; ComponentLink2URL: http://katalog.we-online.com/led/datasheet/150080YS75000.pdf; ComponentLink1Description: Manufacturer URL; ComponentLink2Description: Datasheet; PartNumber: 150080YS75000
P6 = Header 16: Header, 16-Pin; LatestRevisionDate: 17-Jul-2002; LatestRevisionNote: Re-released for DXP Platform.; Publisher: Altium Limited

## Sheet I2C.SchDoc
size A; DocumentNumber: 9; SheetNumber: 9; SheetTotal: 9
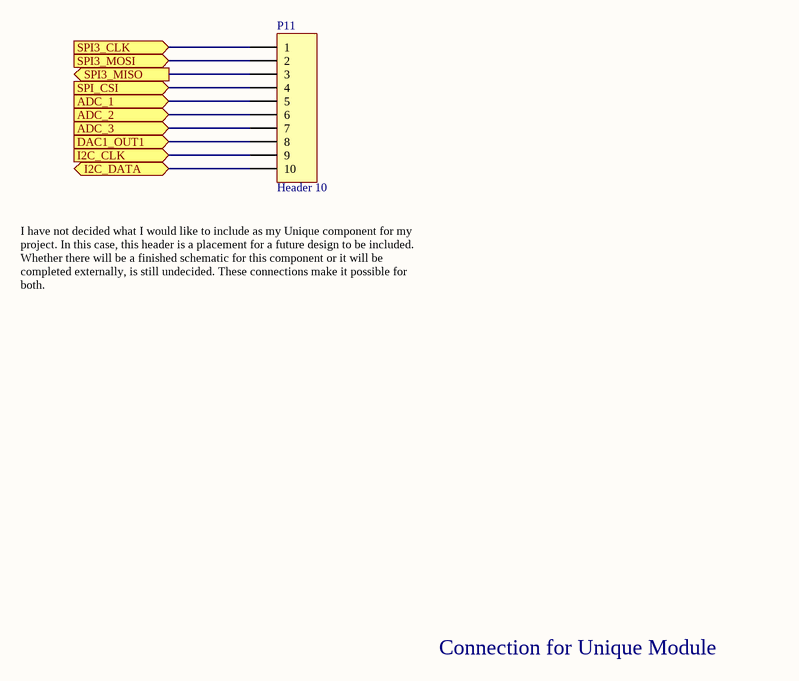
[diagram p8: I2C.SchDoc]

### Parts
P11  Header 10  [HDR1X10]

### Ports
ADC_1 (in), ADC_2 (in), ADC_3 (in), DAC1_OUT1 (in), I2C_CLK (in), I2C_DATA (bidir), SPI3_CLK (in), SPI3_MISO (out), SPI3_MOSI (in), SPI_CSI (in)

### Nets
NetCN1_1: P11.1 ; port SPI3_CLK
NetCN1_2: P11.3 ; port SPI3_MISO
NetCN1_3: P11.2 ; port SPI3_MOSI
NetCN1_4: P11.4 ; port SPI_CSI
NetCN1_32: P11.8 ; port DAC1_OUT1
NetCN1_35: P11.7 ; port ADC_3
NetCN1_36: P11.6 ; port ADC_2
NetCN1_38: P11.5 ; port ADC_1
NetCN2_3: P11.9 ; port I2C_CLK
NetCN2_5: P11.10 ; port I2C_DATA

### Notes on the sheet
- I have not decided what I would like to include as my Unique component for my project. In this case, this header is a placement for a future design to be included. Whether there will be a finished schematic for this component or it will be completed externally, is still undecided. These connections make it possible for both.
- Connection for Unique Module

### Library data of the parts
P11 = Header 10: Header, 10-Pin; LatestRevisionDate: 17-Jul-2002; LatestRevisionNote: Re-released for DXP Platform.; Publisher: Altium Limited

## Nets that join several sheets
3V3: RS232 (C23.1 R14.1 R15.1 U6.16), MCU(64-pin Header) (CN1.16), LCD (P6.2)
5V: MCU(64-pin Header) (CN1.6), CAN (C10.2 U3.3), Camera Module (6 pins), Wheel Module (R10.2 R11.2 R12.1 R13.1), Power Supply (5 pins), LCD (LED1.2)
12V: Camera Module (5 pins), Wheel Module (6 pins)
GND: RS232 (J1.5), CAN (C9.1 C10.1 U3.2 U3.8), Camera Module (22 pins), Wheel Module (16 pins), Power Supply (14 pins), LCD (P6.1 P6.5 P6.16)
NetC9_2: MCU(64-pin Header) (CN2.14), CAN (C9.2 U3.4)
NetCN1_1: MCU(64-pin Header) (CN1.1), I2C (P11.1)
NetCN1_2: MCU(64-pin Header) (CN1.2), I2C (P11.3)
NetCN1_3: MCU(64-pin Header) (CN1.3), I2C (P11.2)
NetCN1_4: MCU(64-pin Header) (CN1.4), I2C (P11.4)
NetCN1_21: MCU(64-pin Header) (CN1.21), LCD (P6.14)
NetCN1_25: RS232 (U6.9), MCU(64-pin Header) (CN1.25)
NetCN1_27: RS232 (U6.10), MCU(64-pin Header) (CN1.27)
NetCN1_28: MCU(64-pin Header) (CN1.28), Wheel Module (U4.10)
NetCN1_30: MCU(64-pin Header) (CN1.30), Wheel Module (U4.9)
NetCN1_32: MCU(64-pin Header) (CN1.32), I2C (P11.8)
NetCN1_34: MCU(64-pin Header) (CN1.34), Wheel Module (U4.1)
NetCN1_35: MCU(64-pin Header) (CN1.35), I2C (P11.7)
NetCN1_36: MCU(64-pin Header) (CN1.36), I2C (P11.6)
NetCN1_37: MCU(64-pin Header) (CN1.37), Camera Module (R1.2 U1.1 U1.11)
NetCN1_38: MCU(64-pin Header) (CN1.38), I2C (P11.5)
NetCN2_1: MCU(64-pin Header) (CN2.1), Camera Module (U1.2)
NetCN2_2: MCU(64-pin Header) (CN2.2), Camera Module (U1.9)
NetCN2_3: MCU(64-pin Header) (CN2.3), I2C (P11.9)
NetCN2_4: MCU(64-pin Header) (CN2.4), Camera Module (U1.19)
NetCN2_5: MCU(64-pin Header) (CN2.5), I2C (P11.10)
NetCN2_6: RS232 (LED3.1 U6.12), MCU(64-pin Header) (CN2.6)
NetCN2_12: MCU(64-pin Header) (CN2.12), CAN (U3.1)
NetCN2_13: MCU(64-pin Header) (CN2.13), Wheel Module (U2.6)
NetCN2_15: MCU(64-pin Header) (CN2.15), Wheel Module (U2.8)
NetCN2_16: MCU(64-pin Header) (CN2.16), LCD (P6.6)
NetCN2_17: MCU(64-pin Header) (CN2.17), LCD (P6.13)
NetCN2_18: MCU(64-pin Header) (CN2.18), Camera Module (D1.1 D2.1 P3.3)
NetCN2_19: MCU(64-pin Header) (CN2.19), Camera Module (U1.12)
NetCN2_21: MCU(64-pin Header) (CN2.21), Wheel Module (R9.1)
NetCN2_22: MCU(64-pin Header) (CN2.22), Camera Module (U2.2)
NetCN2_23: MCU(64-pin Header) (CN2.23), Wheel Module (R8.1)
NetCN2_24: MCU(64-pin Header) (CN2.24), Wheel Module (U4.2)
NetCN2_25: MCU(64-pin Header) (CN2.25), Camera Module (U2.4)
NetCN2_27: MCU(64-pin Header) (CN2.27), LCD (P6.11)
NetCN2_29: MCU(64-pin Header) (CN2.29), LCD (P6.12)
NetCN2_30: MCU(64-pin Header) (CN2.30), LCD (P6.4)
NetCN2_34: RS232 (LED2.1 U6.11), MCU(64-pin Header) (CN2.34)